# EasyEDA schematic 1-Schematic_New Project.json
TITLE: CYT4BB7主板-Device; REV: 1.0; Date: 2024-03-22; Sheet: 3/3; Drawn By: doslike; Company: 这车怎么冒黑烟啊队
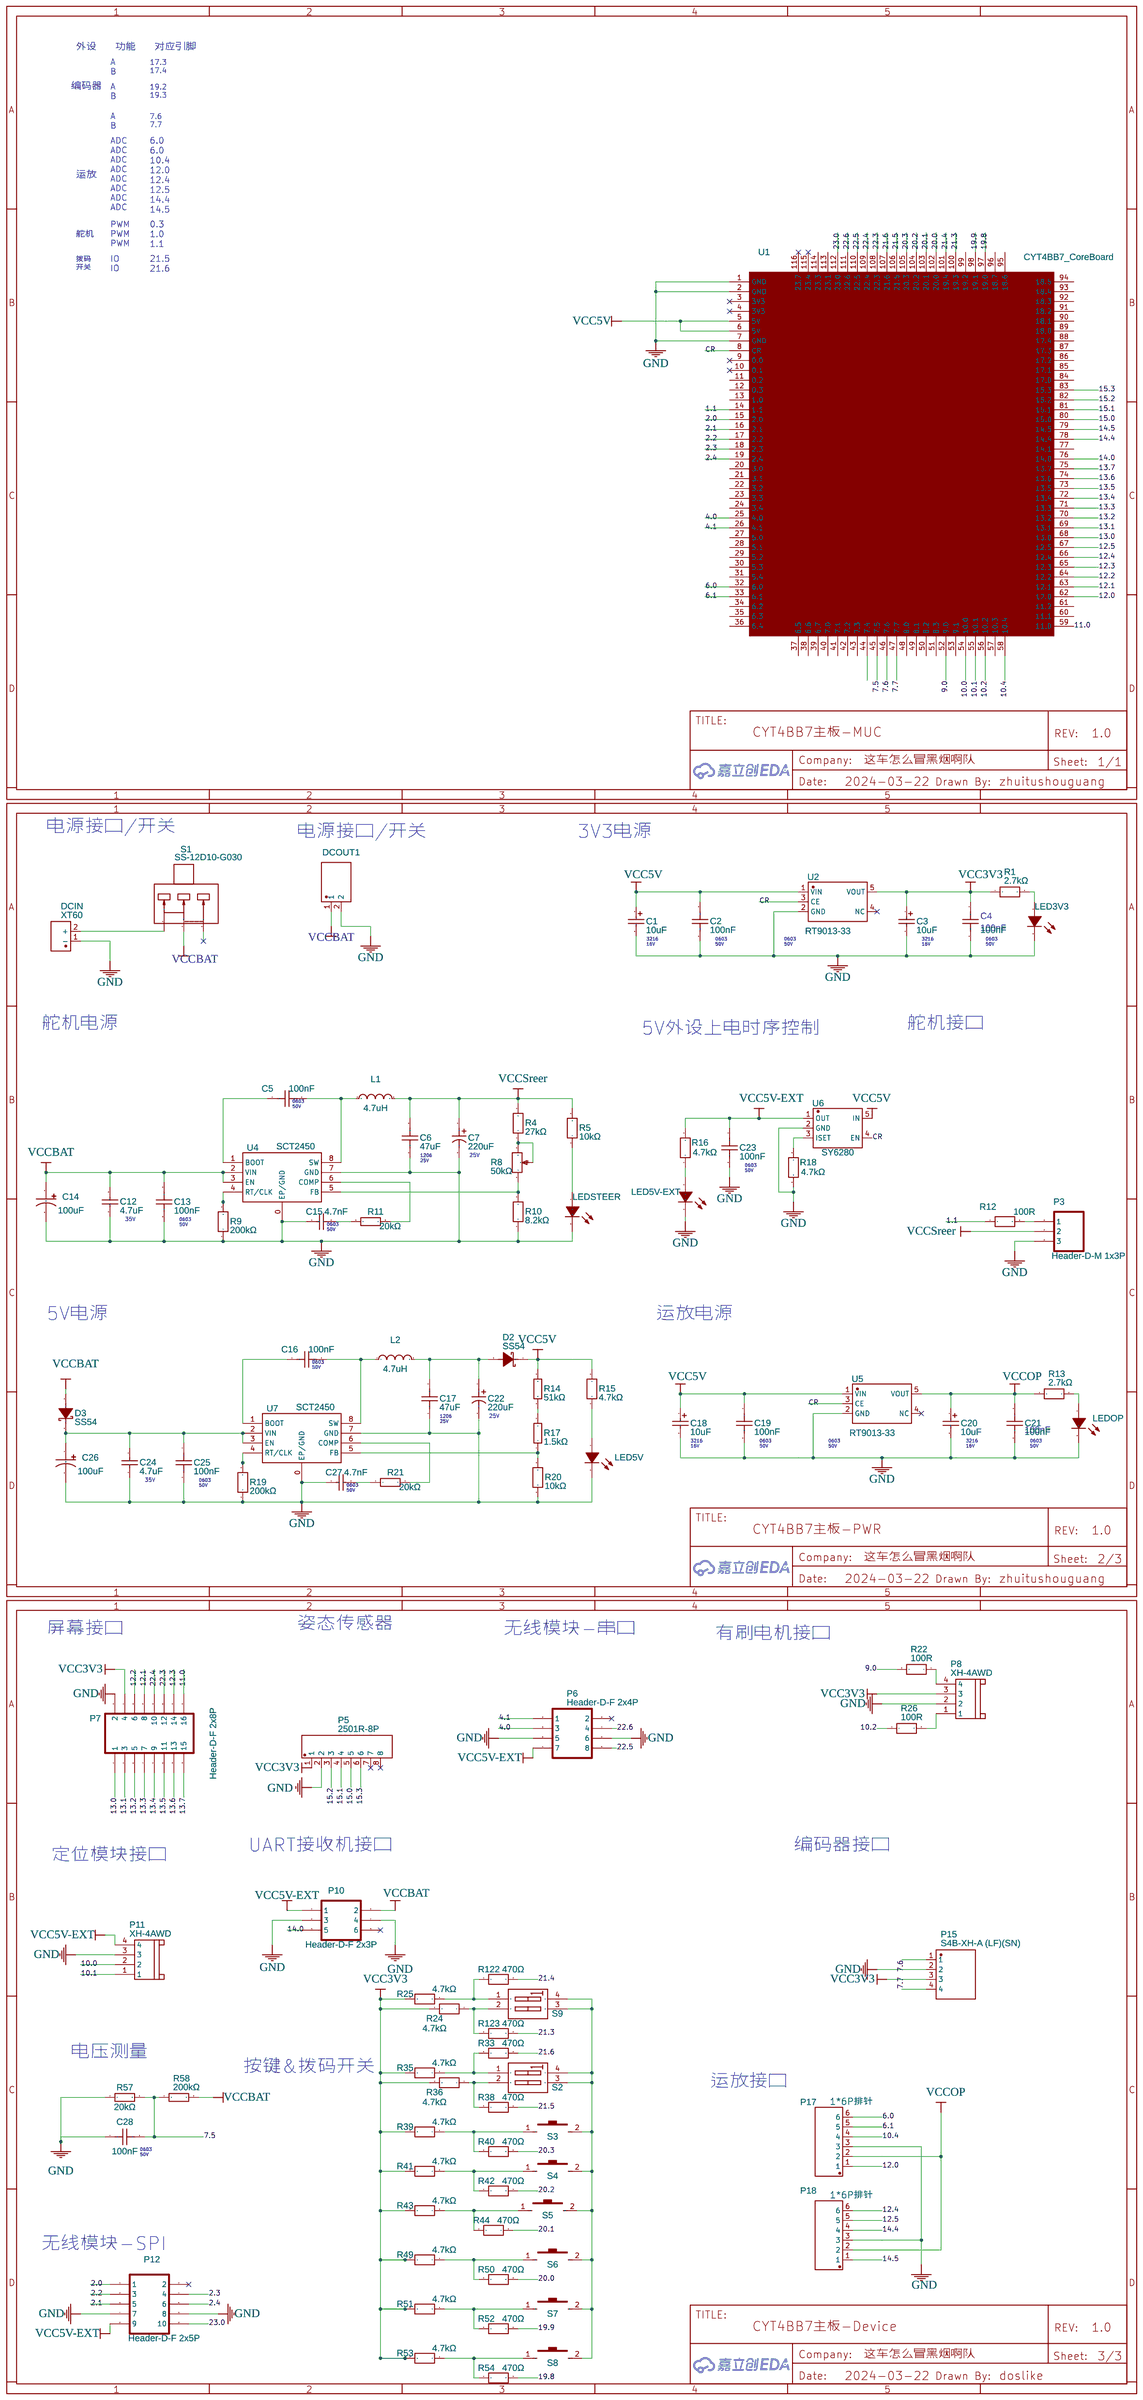
[diagram p0: schematic sheet]

## Parts
C1  10uF  [CASE-A_3216]
C2  100nF  [C0603]
C3  10uF  [CASE-A_3216]
C4  100nF  [C0603]
C5  100nF  [C0603]
C6  47uF  [C1206]
C7  220uF  [CAP-TH_BD6.3-P2.50-D0.6-FD-1]
C12  4.7uF  [C1206]
C13  100nF  [C0603]
C14  100uF  [CAP-TH_BD6.3-P2.50-D0.6-FD]
C15  4.7nF  [0603C]
C16  100nF  [C0603]
C17  47uF  [C1206]
C18  10uF  [CASE-A_3216]
C19  100nF  [C0603]
C20  10uF  [CASE-A_3216]
C21  100nF  [C0603]
C22  220uF  [CAP-TH_BD6.3-P2.50-D0.6-FD-1]
C23  100nF  [C0603]
C24  4.7uF  [C0603]
C25  100nF  [C0603]
C26  100uF  [CAP-TH_BD6.3-P2.50-D0.6-FD]
C27  4.7nF  [0603C]
C28  100nF  [C0603]
D2  SS54  [DO-214AB_L6.9-W5.9-LS7.9-RD]
D3  SS54  [DO-214AB_L6.9-W5.9-LS7.9-RD]
DCIN  XT60  [CONN-TH_XT60]
DCOUT1  DCOUT  [CONN-TH_EK500V-02P]
L1  4.7uH  [IND-SMD_L4.0-W4.0]
L2  4.7uH  [IND-SMD_L4.0-W4.0]
LED3V3  91-21SURC/S530-A2/TR10  [LED-SMD_L2.5-W2.1_91-21SURC-S530-A2-TR10]
LED5V  91-21SURC/S530-A2/TR10  [LED-SMD_L2.5-W2.1_91-21SURC-S530-A2-TR10]
LED5V-EXT  91-21SURC/S530-A2/TR10  [LED-SMD_L2.5-W2.1_91-21SURC-S530-A2-TR10]
LEDOP  91-21SURC/S530-A2/TR10  [LED-SMD_L2.5-W2.1_91-21SURC-S530-A2-TR10]
LEDSTEER  91-21SURC/S530-A2/TR10  [LED-SMD_L2.5-W2.1_91-21SURC-S530-A2-TR10]
P3  Header-D-M 1x3P  [HDR1X3]
P5  2501R-8P  [CONN-TH_8P-P2.54_2501R-8P]
P6  Header-D-F 2x4P  [HDR2X4-F]
P7  Header-D-F 2x8P  [HDR2X8-F-HIGH]
P8  XH-4AWD  [CONN-TH_XH-4AWD]
P10  Header-D-F 2x3P  [HDR2X3-F]
P11  XH-4AWD  [CONN-TH_XH-4AWD]
P12  Header-D-F 2x5P  [HDR2X5-F]
P15  S4B-XH-A (LF)(SN)  [CONN-TH_S4B-XH-A-LF-SN]
P17  1*6P排针  [HDR-2.54-FX-1X6PW]
P18  1*6P排针  [HDR-2.54-FX-1X6PW]
R1  2.7kΩ  [R0603]
R4  27kΩ  [R0603]
R5  10kΩ  [R0603]
R8  50kΩ  [RES-ADJ-TH_3P-L9.5-W4.9-P2.50-L_3296W]
R9  200kΩ  [R0603]
R10  8.2kΩ  [R0603]
R11  20kΩ  [R0603]
R12  100R  [R0603]
R13  2.7kΩ  [R0603]
R14  51kΩ  [R0603]
R15  4.7kΩ  [R0603]
R16  4.7kΩ  [R0603]
R17  1.5kΩ  [R0603]
R18  4.7kΩ  [R0603]
R19  200kΩ  [R0603]
R20  10kΩ  [R0603]
R21  20kΩ  [R0603]
R22  100R  [R0603]
R24  4.7kΩ  [R0603]
R25  4.7kΩ  [R0603]
R26  100R  [R0603]
R33  470Ω  [R0603]
R35  4.7kΩ  [R0603]
R36  4.7kΩ  [R0603]
R38  470Ω  [R0603]
R39  4.7kΩ  [R0603]
R40  470Ω  [R0603]
R41  4.7kΩ  [R0603]
R42  470Ω  [R0603]
R43  4.7kΩ  [R0603]
R44  470Ω  [R0603]
R49  4.7kΩ  [R0603]
R50  470Ω  [R0603]
R51  4.7kΩ  [R0603]
R52  470Ω  [R0603]
R53  4.7kΩ  [R0603]
R54  470Ω  [R0603]
R57  20kΩ  [R0603]
R58  200kΩ  [R0603]
R122  470Ω  [R0603]
R123  470Ω  [R0603]
S1  SS-12D10-G030  [SW-TH_SS-12D10G12]
S2  CDH-02  [SW-TH_CDH-02]
S3  8:5h Camera switch  [SW-TH_8-5H]
S4  8:5h Camera switch  [SW-TH_8-5H]
S5  8:5h Camera switch  [SW-TH_8-5H]
S6  8:5h Camera switch  [SW-TH_8-5H]
S7  8:5h Camera switch  [SW-TH_8-5H]
S8  8:5h Camera switch  [SW-TH_8-5H]
S9  CDH-02  [SW-TH_CDH-02]
U1  CYT4BB7_CoreBoard  [CYT4BB7CEX_COREBOARD_V1.X]
U2  RT9013-33  [SOT-23-5_L2.9-W1.6-P0.95-LS2.8-BR]
U4  SCT2450  [SOP-8E]
U5  RT9013-33  [SOT-23-5_L2.9-W1.6-P0.95-LS2.8-BR]
U6  SY6280  [SOT-23-5_L3.0-W1.7-P0.95-LS2.8-BL]
U7  SCT2450  [SOP-8E]

## Library data of the parts
C1 C3 C18 C20 = CA45A-A-16V-10UF-K: Contributor: LCSC; Supplier: LCSC; Manufacturer: CEC(振华新云); Manufacturer Part: CA45A-A-16V-10uF-K; Supplier Part: C129279; JLCPCB Part Class: Extended Part
C2 C4 C5 C13 C16 C19 C21 C23 C25 C28 = 100NF/0603/50V: Contributor: lcsc; Supplier: LCSC; Supplier Part: C9900013340; Manufacturer: null; Manufacturer Part: 100nF/0603/50V; JLCPCB Part Class: Extended Part
C6 C17 = 47UF, 25V,10%-1206: Contributor: LCSC; Supplier: LCSC; Supplier Part: C9900001437; Manufacturer: null; Manufacturer Part: 47uF, 25V,10%-1206; JLCPCB Part Class: Extended Part
C7 C22 = KNE2220UF25V149EC0030: Contributor: lcsc; Supplier: LCSC; Supplier Part: C2943986; Manufacturer: KNSCHA(科尼盛)
C12 C24 = 12065C475KAT4A: Supplier: LCSC; Manufacturer: Kyocera AVX; Manufacturer Part: 12065C475KAT2A; Supplier Part: C141667; JLCPCB Part Class: Extended Part
C14 C26 = 16NA100MEFC6.3X11: Contributor: lcsc; Supplier: LCSC; Supplier Part: C1583777; Manufacturer: rubycon(红宝石)
C15 C27 = 0603-4.7nF-50V-10%-NPO: Supplier: LCSC; Manufacturer Part: C0603N472J050T; Manufacturer: HEC(禾伸堂); LCSC Assembly: Yes; Contributor: DSTS; 公司编号: 11010036
D2 D3 = SS54: Supplier: LCSC; Supplier Part: C19272197; Manufacturer: Zhengxin(正芯); Contributor: lcsc
DCIN = XT60: Contributor: lcsc; Supplier: LCSC; Supplier Part: C98733; Manufacturer: AMASS(艾迈斯); JLCPCB Part Class: Extended Part
DCOUT1 = EK500V-02P: Contributor: LCSC; Supplier: LCSC; Supplier Part: C182802; Manufacturer: dinkle(町洋); JLCPCB Part Class: Extended Part
L1 L2 = CKCS4020-4.7UH/M: Contributor: LCSC; Supplier: LCSC; Supplier Part: C354581; Manufacturer: CENKER(岑科); Manufacturer Part: CKCS4020-4.7uH/M; JLCPCB Part Class: Extended Part
LED3V3 LED5V LED5V-EXT LEDOP LEDSTEER = 91-21SURC/S530-A2/TR10: Contributor: LCSC; Supplier: LCSC; Supplier Part: C183822; Manufacturer: EVERLIGHT(亿光)
P3 = Header-D-M 1x3P: Revision: V1.0; Contributor: ooooooou
P5 = 2501R-8P: Contributor: LCSC; Supplier: LCSC; Manufacturer: Ckmtw(灿科盟); Manufacturer Part: W-2501R08P-N000; Supplier Part: C132466; JLCPCB Part Class: Extended Part
P6 = Header-D-F 2x4P: Revision: V1.0; Contributor: tys66
P7 = Header-D-F 2x8P: Revision: V1.0; Contributor: hhhh1111000
P8 P11 = XH-4AWD: Supplier: LCSC; Manufacturer: BOOMELE(博穆精密); Supplier Part: C8877; JLCPCB Part Class: Extended Part
P10 = Header-D-F 2x3P: Revision: V1.0; Contributor: xinqi0702
P12 = Header-D-F 2x5P: Revision: V1.0; Comment: Header 5x2 F; Contributor: scuzyt123
P15 = S4B-XH-A (LF)(SN): Contributor: LCSC; Supplier: LCSC; Supplier Part: C157925; Manufacturer: JST; Manufacturer Part: S4B-XH-A(LF)(SN); JLCPCB Part Class: Extended Part
P17 P18 = 2.54mm 1*6P排针: Supplier: LCSC; Manufacturer: BOOMELE; Manufacturer Part: 2.54mm 1*40P Reverse bending Headers  Pins; image: //image.lceda.cn/szlcsc/C74252.jpg; Supplier Part: C74252; Contributor: maoer
R1 R13 = FRC2010F2701TS: Supplier: LCSC; Supplier Part: C2974099; Manufacturer: FOJAN(富捷); JLCPCB Part Class: Extended Part; Contributor: lcsc
R4 = MMA02040E2702BB300: Contributor: lcsc; Supplier: LCSC; Supplier Part: C1716654; Manufacturer: VISHAY(威世); JLCPCB Part Class: Extended Part
R5 = AR05DTD1002: Contributor: lcsc; Supplier: LCSC; Supplier Part: C5120082; Manufacturer: Viking(光颉); JLCPCB Part Class: Extended Part
R8 = 3296W-1-503_C330434: Resistance(Ohms): 50K; Contributor: LCSC; Supplier: LCSC; Supplier Part: C330434; Manufacturer: BOCHEN(博晨); Manufacturer Part: 3296W-1-503-8mm; JLCPCB Part Class: Extended Part
R9 R19 = FRC1812J204 TS: Contributor: lcsc; Supplier: LCSC; Supplier Part: C2933936; Manufacturer: FOJAN(富捷); JLCPCB Part Class: Extended Part
R10 = 0201WMJ0822TEE: Contributor: LCSC; Supplier: LCSC; Supplier Part: C473592; Manufacturer: UNI-ROYAL(厚声)
R11 R21 = SG73S1JTTD203J: Contributor: lcsc; Supplier: LCSC; Supplier Part: C4319588; Manufacturer: KOA
R12 R22 R26 = AC0402DR-07100RL: Contributor: LCSC; Supplier: LCSC; Supplier Part: C226677; Manufacturer: YAGEO(国巨); JLCPCB Part Class: Extended Part
R14 = 0805W8F5102T5E: Supplier: LCSC; Manufacturer: UNI-ROYAL(厚声); Supplier Part: C17737; JLCPCB Part Class: Basic Part
R15 R16 R18 R24 R25 R35 R36 R39 R41 R43 R49 R51 R53 = 1206 ±5% 4K7: Contributor: lcsc; Supplier: LCSC; Supplier Part: C2889721; Manufacturer: VO(翔胜); JLCPCB Part Class: Extended Part
R17 = 0402WGF1501TCE: Supplier: LCSC; Manufacturer: UNI-ROYAL(厚声); Supplier Part: C25867; JLCPCB Part Class: Basic Part
R20 = AR03BTD1002: Contributor: lcsc; Supplier: LCSC; Supplier Part: C2992491; Manufacturer: Viking(光颉); JLCPCB Part Class: Extended Part
R33 R38 R40 R42 R44 R50 R52 R54 R122 R123 = SCR1206F470R: Contributor: lcsc; Supplier: LCSC; Supplier Part: C3017210; Manufacturer: VO(翔胜); JLCPCB Part Class: Extended Part
R57 = WR08X203JTL: Contributor: LCSC; Supplier: LCSC; Manufacturer: Walsin(华新科); Supplier Part: C163978; JLCPCB Part Class: Extended Part
R58 = WR12X204JTL: Contributor: LCSC; Supplier: LCSC; Manufacturer: Walsin(华新科); Supplier Part: C168570; JLCPCB Part Class: Extended Part
S1 = SS-12D10-G030: Supplier: LCSC; Supplier Part: C5155547; Manufacturer: G-Switch(品赞); JLCPCB Part Class: Extended Part; Contributor: lcsc
S2 S9 = CDH-02: Contributor: LCSC; Supplier: LCSC; Supplier Part: C360665; Manufacturer: Cha(昭华); JLCPCB Part Class: Extended Part
S3-S8 = 8:5h Camera switch: Supplier: LCSC; Manufacturer: null; Manufacturer Part: 8:5h 相机开关; Supplier Part: C3664; JLCPCB Part Class: Extended Part
U1 = CYT4BB7CEx_CoreBoard: Contributor: ZCY3518
U2 U5 = RT9013-33GB_C19268157: Supplier: LCSC; Supplier Part: C19268157; Manufacturer: TECH PUBLIC(台舟); Manufacturer Part: RT9013-33GB; Contributor: lcsc; JLCPCB Part Class: Extended Part
U4 U7 = SCT2450: Contributor: 708yuge
U6 = SY6280AAC: Supplier: LCSC; Manufacturer: silergy(矽力杰); Supplier Part: C55136; JLCPCB Part Class: Extended Part

## Nets
GND: C1.2 C2.2 C3.2 C4.2 C6.1 C7.2 C12.1 C13.2 C14.2 C15.1 C17.1 C18.2 C19.2 C20.2 C21.2 C22.2 C23.2 C24.1 C25.2 C26.2 C27.1 C28.1 DCIN.1(-) DCOUT1.2 LED3V3.2(K) LED5V.2(K) LED5V-EXT.2(K) LEDOP.2(K) LEDSTEER.2(K) P3.3 P5.2 P6.5 P6.6 P7.2 P8.2 P10.3 P10.4 P11.3 P12.7 P12.8 P15.2 P17.3 P18.3 R9.1 R10.1 R18.1 R19.1 R20.1 R57.1 U1.1(GND) U1.2(GND) U1.7(GND) U2.2(GND) U4.0(EP/GND) U4.7(GND) U5.2(GND) U6.2(GND) U7.0(EP/GND) U7.7(GND)
VCC3V3: C3.1 C4.1 P5.1 P7.4 P8.3 P15.3 R1.1 R24.2 R25.2 R35.2 R36.2 R39.2 R41.2 R43.2 R49.2 R51.2 R53.2 U2.5(VOUT)
VCC5V: C1.1 C2.1 C18.1 C19.1 D2.1(K) R14.2 R15.2 U1.5(5V) U1.6(5V) U2.1(VIN) U5.1(VIN) U6.5(IN)
VCC5V-EXT: C23.1 P6.7 P10.1 P11.4 P12.9 R16.2 U6.1(OUT)
VCCBAT: C12.2 C13.1 C14.1 D3.2(A) DCOUT1.1 P10.2 R58.2 S1.2 U4.2(VIN) U4.3(EN)
VCCOP: C20.1 C21.1 P17.2 P18.2 R13.1 U5.5(VOUT)
VCCSreer: C6.2 C7.1 L1.2 P3.2 R4.2 R5.2
1.1: R12.1 U1.14(1.1)
2.0: P12.1 U1.15(2.0)
2.1: P12.5 U1.16(2.1)
2.2: P12.3 U1.17(2.2)
2.3: P12.4 U1.18(2.3)
2.4: P12.6 U1.19(2.4)
4.0: P6.3 U1.25(4.0)
4.1: P6.1 U1.26(4.1)
6.0: P17.6 U1.32(6.0)
6.1: P17.5 U1.33(6.1)
7.5: C28.2 R57.2 R58.1 U1.45(7.5)
7.6: P15.1 U1.46(7.6)
7.7: P15.4 U1.47(7.7)
9.0: R22.2 U1.52(9.0)
10.0: P11.2 U1.54(10.0)
10.1: P11.1 U1.55(10.1)
10.2: R26.1 U1.56(10.2)
10.4: P17.4 U1.58(10.4)
11.0: P7.16 U1.59(11.0)
12.0: P17.1 U1.62(12.0)
12.1: P7.8 U1.63(12.1)
12.2: P7.6 U1.64(12.2)
12.3: P7.14 U1.65(12.3)
12.4: P18.6 U1.66(12.4)
12.5: P18.5 U1.67(12.5)
13.0: P7.1 U1.68(13.0)
13.1: P7.3 U1.69(13.1)
13.2: P7.5 U1.70(13.2)
13.3: P7.7 U1.71(13.3)
13.4: P7.9 U1.72(13.4)
13.5: P7.11 U1.73(13.5)
13.6: P7.13 U1.74(13.6)
13.7: P7.15 U1.75(13.7)
14.0: P10.5 U1.76(14.0)
14.4: P18.4 U1.78(14.4)
14.5: P18.1 U1.79(14.5)
15.0: P5.5 U1.80(15.0)
15.1: P5.4 U1.81(15.1)
15.2: P5.3 U1.82(15.2)
15.3: P5.6 U1.83(15.3)
19.8: R54.2 U1.97(19.0)
19.9: R52.2 U1.98(19.1)
20.0: R50.2 U1.102(20.0)
20.1: R44.2 U1.103(20.1)
20.2: R42.2 U1.104(20.2)
20.3: R40.2 U1.105(20.3)
21.3: R123.2 U1.100(19.3)
21.4: R122.2 U1.101(19.4)
21.5: R38.2 U1.106(21.5)
21.6: R33.2 U1.107(21.6)
22.3: P7.12 U1.108(22.3)
22.4: P7.10 U1.109(22.4)
22.5: P6.8 U1.110(22.5)
22.6: P6.4 U1.111(22.6)
23.0: P12.10 U1.112(23.0)
CR: U1.8(CR) U2.3(CE) U5.3(CE) U6.4(EN)
Net-(C5-1): C5.1 U4.1(BOOT)
Net-(C5-2): C5.2 L1.1 U4.8(SW)
Net-(C15-2): C15.2 R11.1
Net-(C16-1): C16.1 U7.1(BOOT)
Net-(C16-2): C16.2 L2.1 U7.8(SW)
Net-(C17-2): C17.2 C22.1 D2.2(A) L2.2
Net-(C24-2): C24.2 C25.1 C26.1 D3.1(K) U7.2(VIN) U7.3(EN)
Net-(C27-2): C27.2 R21.1
Net-(DCIN-2): DCIN.2(+) S1.1
Net-(LED3V3-1): LED3V3.1(A) R1.2
Net-(LED5V-1): LED5V.1(A) R15.1
Net-(LED5V-EXT-1): LED5V-EXT.1(A) R16.1
Net-(LEDOP-1): LEDOP.1(A) R13.2
Net-(LEDSTEER-1): LEDSTEER.1(A) R5.1
Net-(P3-1): P3.1 R12.2
Net-(P8-1): P8.1 R26.2
Net-(P8-4): P8.4 R22.1
Net-(R4-1): R4.1 R8.2 R8.3
Net-(R8-1): R8.1 R10.2 U4.5(FB)
Net-(R9-2): R9.2 U4.4(RT/CLK)
Net-(R11-2): R11.2 U4.6(COMP)
Net-(R14-1): R14.1 R17.2
Net-(R17-1): R17.1 R20.2 U7.5(FB)
Net-(R18-2): R18.2 U6.3(ISET)
Net-(R19-2): R19.2 U7.4(RT/CLK)
Net-(R21-2): R21.2 U7.6(COMP)
Net-(R24-1): R24.1 R123.1 S9.2
Net-(R25-1): R25.1 R122.1 S9.1
Net-(R33-1): R33.1 R35.1 S2.1
Net-(R36-1): R36.1 R38.1 S2.2
Net-(R39-1): R39.1 R40.1 S3.1
Net-(R41-1): R41.1 R42.1 S4.1
Net-(R43-1): R43.1 R44.1 S5.1
Net-(R49-1): R49.1 R50.1 S6.1
Net-(R51-1): R51.1 R52.1 S7.1
Net-(R53-1): R53.1 R54.1 S8.1
Net-(S2-3): S2.3 S2.4 S3.2 S4.2 S5.2 S6.2 S7.2 S8.2 S9.3 S9.4

Not connected (* = marked no-connect by the designer): P5 7* 8*; P6 2*; P10 6*; P12 2*; S1 3; U1 3(3V3)* 4(3V3)* 9(0.0)* 10(0.1)* 11(0.2) 12(0.3) 13(1.0) 20(3.0) 21(3.1) 22(3.2) 23(3.3) 24(3.4) 27(5.0) 28(5.1) 29(5.2) 30(5.3) 31(5.4) 34(6.2) 35(6.3) 36(6.4) 37(6.5) 38(6.6) 39(6.7) 40(7.0) 41(7.1) 42(7.2) 43(7.3) 44(7.4) 48(8.0) 49(8.1) 50(8.2) 51(8.3) 53(9.1) 57(10.3) 60(11.1) 61(11.2) 77(14.1) 84(17.0) 85(17.1) 86(17.2) 87(17.3) 88(17.4) 89(18.0) 90(18.1) 91(18.2) 92(18.3) 93(18.4) 94(18.5) 95(18.6) 96(18.7) 99(19.2) 113(23.1) 114(23.3) 115(23.4)* 116(23.7)*; U2 4(NC)*; U5 4(NC)*

## Notes on the sheet
- 外设
- 功能
- 对应引脚
- A
  B
- 17.3
  17.4
- 编码器
- A
  B
- 19.2
  19.3
- A
  B
- 7.6
  7.7
- ADC
  ADC
  ADC
  ADC
  ADC
  ADC
  ADC
  ADC
- 6.0
- 6.0
- 10.4
- 运放
- 12.0
- 12.4
- 12.5
- 14.4
- 14.5
- 舵机
- PWM
  PWM
  PWM
- 0.3
- 1.0
- 1.1
- 21.5
- 拨码
  开关
- IO
  IO
- 21.6
- 电源接口/开关
- 电源接口/开关
- 3V3电源
- C4
- 100nF
- 3216
  16V
- 0603
  50V
- 0603
  50V
- 3216
  16V
- 0603
  50V
- 舵机电源
- 5V外设上电时序控制
- 舵机接口
- 0603
  50V
- 1206
  25V
- 25V
- 0603
  50V
- 35V
- 0603
  50V
- 0603
  50V
- 5V电源
- 运放电源
- 0603
  50V
- 1206
  25V
- 25V
- 100nF
- 3216
  16V
- 0603
  50V
- 0603
  50V
- 3216
  16V
- 0603
  50V
- 35V
- 0603
  50V
- 0603
  50V
- 屏幕接口
- 姿态传感器
- 无线模块-串口
- 有刷电机接口
- 定位模块接口
- UART接收机接口
- 编码器接口
- 联轴器
- 电压测量
- 按键&拨码开关
- 运放接口
- 0603
- 0603
  50V
- 无线模块-SPI
